# EAGLE design RPi-I2C-LevelShifter (EAGLE 9.5.2)
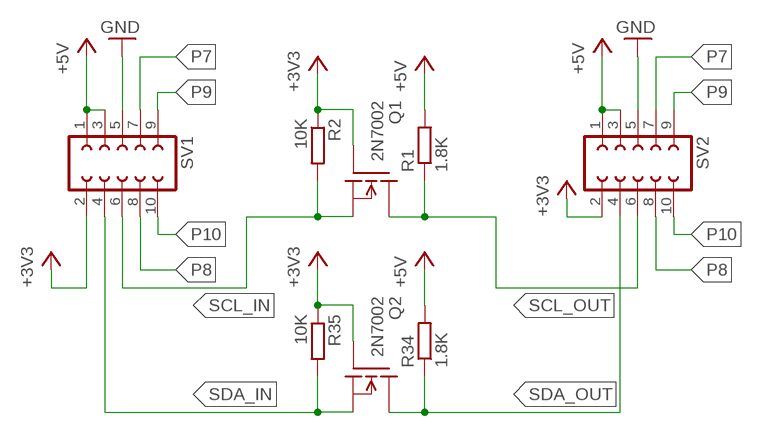
[diagram p0: schematic, sheet 1]

## Parts
Q1  2N7002  [SOT23]
Q2  2N7002  [SOT23]
R1  1.8K  R-EU_R0805  [R0805]
R2  10K  R-EU_R0805  [R0805]
R34  1.8K  R-EU_R0805  [R0805]
R35  10K  R-EU_R0805  [R0805]
SV1  FE05-2  [FE05-2]
SV2  FE05-2  [FE05-2]

## Nets
+3V3: Q1.1(G) Q2.1(G) R2.1 R35.1 SV1.2 SV2.2
+5V: R1.2 R34.2 SV1.1 SV1.3 SV2.1 SV2.3
GND: SV1.5 SV2.5
P7: SV1.7 SV2.7
P8: SV1.8 SV2.8
P9: SV1.9 SV2.9
P10: SV1.10 SV2.10
SCL_IN: Q1.2(S) R2.2 SV1.6
SCL_OUT: Q1.3(D) R1.1 SV2.6
SDA_IN: Q2.2(S) R35.2 SV1.4
SDA_OUT: Q2.3(D) R34.1 SV2.4

## Library data of the parts
Q1 Q2 = transistors_gaui:2N7002
R1 R2 R34 R35 = rcl:R-EU_: RESISTOR, European symbol; SPICEPREFIX: R
SV1 SV2 = con-lsta:FE05-2: FEMALE HEADER; OC_FARNELL: unknown; OC_NEWARK: unknown

## Board
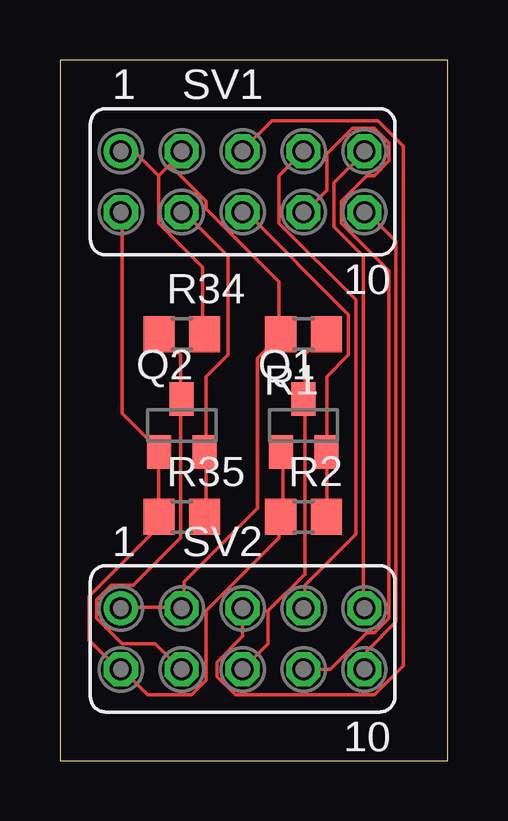
[diagram p1: board, top side]

Size 16.18 x 29.2 mm. Coordinates in mm from the lower left corner, seen from the top.
Outline: 0,0 16.18,0 16.18,29.2 0,29.2 0,0
Copper layers (1*16): Top 0.035mm / dielectric 1.5mm / Bottom 0.035mm
Design rules "default": minimum track width 6mil, minimum drill 0.35mm, track to track 6mil, track to pad 6mil, pad to pad 6mil, via to via 6mil, smd to smd 6mil, copper to edge 40mil, drill to drill 6mil, minimum pad ring 10mil, minimum via ring 8mil, stop-mask expansion 4mil, vias tented up to drill 0mil, thermal gap 10mil

### Footprints (pad centres in the part's own frame; a part is rotated, then mirrored left to right if it is on the bottom)
SOT23 = smd 1 x 1.4: 1 -0.95,-1.1; 2 0.95,-1.1; 3 0,1.1
R0805 = smd 1.3 x 1.5: 1 -0.95,0; 2 0.95,0
FE05-2 = drill 0.914: 1 -5.08,1.27 | drill 0.914 octagon: 2 -5.08,-1.27; 3 -2.54,1.27; 4 -2.54,-1.27; 5 0,1.27; 6 0,-1.27; 7 2.54,1.27; 8 2.54,-1.27; 9 5.08,1.27; 10 5.08,-1.27

### Placement (x,y rotation side)
Q1  10.16,13.97 0 top
Q2  5.08,13.97 0 top
R1  10.16,17.78 180 top
R2  10.16,10.16 0 top
R34  5.08,17.78 0 top
R35  5.08,10.16 0 top
SV1  7.62,24.13 0 top
SV2  7.62,5.08 0 top

### Tracks (layer width: path | path; a pad name or v marks a point on that pad's centre or on a via)
+3V3
  Top 0.152: Q1.1 9.3,12.8 9.3,10.21 R2.1 9.14,10.06 9.14,9.3 6.1,6.25 6.1,3.35 5.49,2.74 3.66,2.74 2.59,3.81 SV2.2 2.44,3.81 1.22,5.03 1.22,6.86 4.12,9.75 4.12,10.06 R35.1 4.12,10.21 4.12,12.8 Q2.1 4.12,12.95 2.59,14.48 2.59,22.86 SV1.2
+5V
  Top 0.152: SV2.1 2.59,6.4 5.03,6.4 SV2.3 5.18,6.4 5.18,7.47 8.23,10.52 8.23,16.76 9.14,17.68 R1.2 9.14,17.83 9.14,19.96 6.1,23.01 6.1,23.32 4.57,24.84 | 4.12,24.38 4.12,22.4 5.94,20.57 5.94,17.83 R34.2 | 4.57,24.84 5.03,25.3 SV1.3 | 4.57,24.84 4.12,24.38 | 4.12,24.38 3.2,25.3 2.59,25.3 SV1.1
GND
  Top 0.152: SV2.5 7.62,5.18 6.55,4.12 6.55,3.5 7.32,2.74 13.11,2.74 14.33,3.96 14.33,25.6 13.26,26.67 8.84,26.67 7.62,25.45 SV1.5
P7
  Top 0.152: SV1.7 9.14,24.38 9.14,22.4 12.34,19.2 12.34,9.45 10.21,7.32 10.21,6.4 SV2.7
P8
  Top 0.152: SV2.8 11.28,3.81 12.8,5.33 13.11,5.33 13.72,5.94 13.72,20.42 11.73,22.4 11.73,23.32 12.8,24.38 13.11,24.38 13.72,24.99 13.72,25.76 13.11,26.36 12.19,26.36 11.12,25.3 11.12,23.77 10.21,22.86 SV1.8
P9
  Top 0.152: SV2.9 12.65,6.4 12.65,21.03 11.43,22.25 11.43,24.08 12.65,25.3 SV1.9
P10
  Top 0.152: SV2.10 12.8,3.81 12.8,4.57 14.02,5.79 14.02,21.64 12.8,22.86 SV1.10
SCL_IN
  Top 0.152: R2.2 11.12,10.21 11.12,12.8 Q1.2 11.12,12.95 11.12,16 12.04,16.92 12.04,18.59 7.77,22.86 SV1.6
SCL_OUT
  Top 0.152: R1.1 10.97,17.68 10.21,16.92 10.21,15.09 Q1.3 10.21,14.94 10.21,7.77 8.69,6.25 8.69,4.88 SV2.6
SDA_IN
  Top 0.152: R35.2 6.1,10.21 6.1,12.8 Q2.2 6.1,12.95 6.1,16 7.01,16.92 7.01,21.03 5.18,22.86 SV1.4
SDA_OUT
  Top 0.152: R34.1 4.27,17.68 5.03,16.92 5.03,15.09 Q2.3 5.03,14.94 5.03,9.3 3.05,7.32 2.13,7.32 1.52,6.71 1.52,5.94 2.59,4.88 3.96,4.88 5.03,3.81 SV2.4